# Altium schematic sheet 555_A-stable.SchDoc
size A4
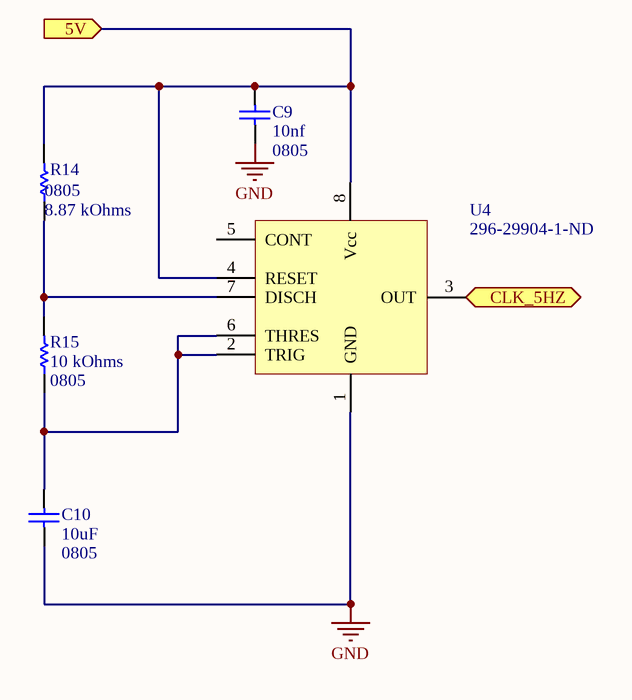
[diagram p0: 555_A-stable.SchDoc]

## Parts
C9  Capacitance: 10nf  Package / Case: 0805  [CAP0805]  (hidden comment: CGA4C2C0G1H103J060AA)
C10  Capacitance: 10uF  Package / Case: 0805  [CAP0805]  (hidden comment: C2012JB1V106K125AC)
R14  Package / Case: 0805  Resistance: 8.87 kOhms  [RES0805]  (hidden comment: ERJ-6ENF8871V)
R15  Resistance: 10 kOhms  Package / Case: 0805  [RES0805]  (hidden comment: RC0805FR-0710KL)
U4  Supplier Part Number 1: 296-29904-1-ND  [TSOP65P650X120-8N]  (hidden comment: NE555PWR)

## Ports
5V (in), CLK_5HZ (out)

## Nets
GND: C9.1 C10.1 U4.1(GND)
5V: C9.2 R14.2 U4.4(RESET) U4.8(Vcc) ; port 5V
CLK_5HZ: U4.3(OUT) ; port CLK_5HZ
NetC10_2: C10.2 R15.1 U4.2(TRIG) U4.6(THRES)
NetR14_1: R14.1 R15.2 U4.7(DISCH)

Not connected (* = marked no-connect by the designer): U4 5(CONT)

## Library data of the parts
C9 = CGA4C2C0G1H103J060AA: CAP CER 10000PF 50V C0G 0805; Tolerance: ±5%; Supplier 1: Digi-Key; Supplier Part Number 1: 445-6947-1-ND; Voltage - Rated: 50V; Thickness: 0.7mm; Operating Temperature: -55°C ~ 125°C
C10 = C2012JB1V106K125AC: CAP CER 10UF 35V JB 0805; Tolerance: ±20%; Supplier 1: Digi-Key; Supplier Part Number 1: 445-11517-1-ND; Voltage - Rated: 35V
R14 = ERJ-6ENF8871V: RES SMD 8.87K OHM 1% 1/8W 0805; Power (Watts): 0.125W, 1/8W; Supplier 1: Digi-Key; Tolerance: ±1%; Features: Automotive AEC-Q200; Operating Temperature: -55°C ~ 155°C; Height - Seated (Max): 0.028" (0.70mm)
R15 = RC0805FR-0710KL: RES SMD 10K OHM 1% 1/8W 0805; Manufacturer: Yageo; Power (Watts): 0.125W, 1/8W; Temperature Coefficient: ±100ppm/°C; Supplier 1: Digi-Key; Supplier Part Number 1: 311-10.0KCRCT-ND; Tolerance: ±1%; Composition: Thick Film; Features: Moisture Resistant; Operating Temperature: -55°C ~ 155°C
U4 = NE555PWR: IC OSC SGL TIMER 100KHZ 8TSSOP; Detailed Description: 555 Type, Timer/Oscillator (Single) IC 100kHz 8-TSSOP; Voltage - Supply: 4.5 V ~ 16 V; Current - Supply: 10mA; Supplier 1: Digi-Key; Type: 555 Type, Timer/Oscillator (Single); Operating Temperature: 0°C ~ 70°C; Package / Case: 8-TSSOP (0.173", 4.40mm Width); Mounting Type: Surface Mount; Frequency: 100kHz